# EAGLE design Height_Gauge-2-1 (EAGLE 7.0.0)
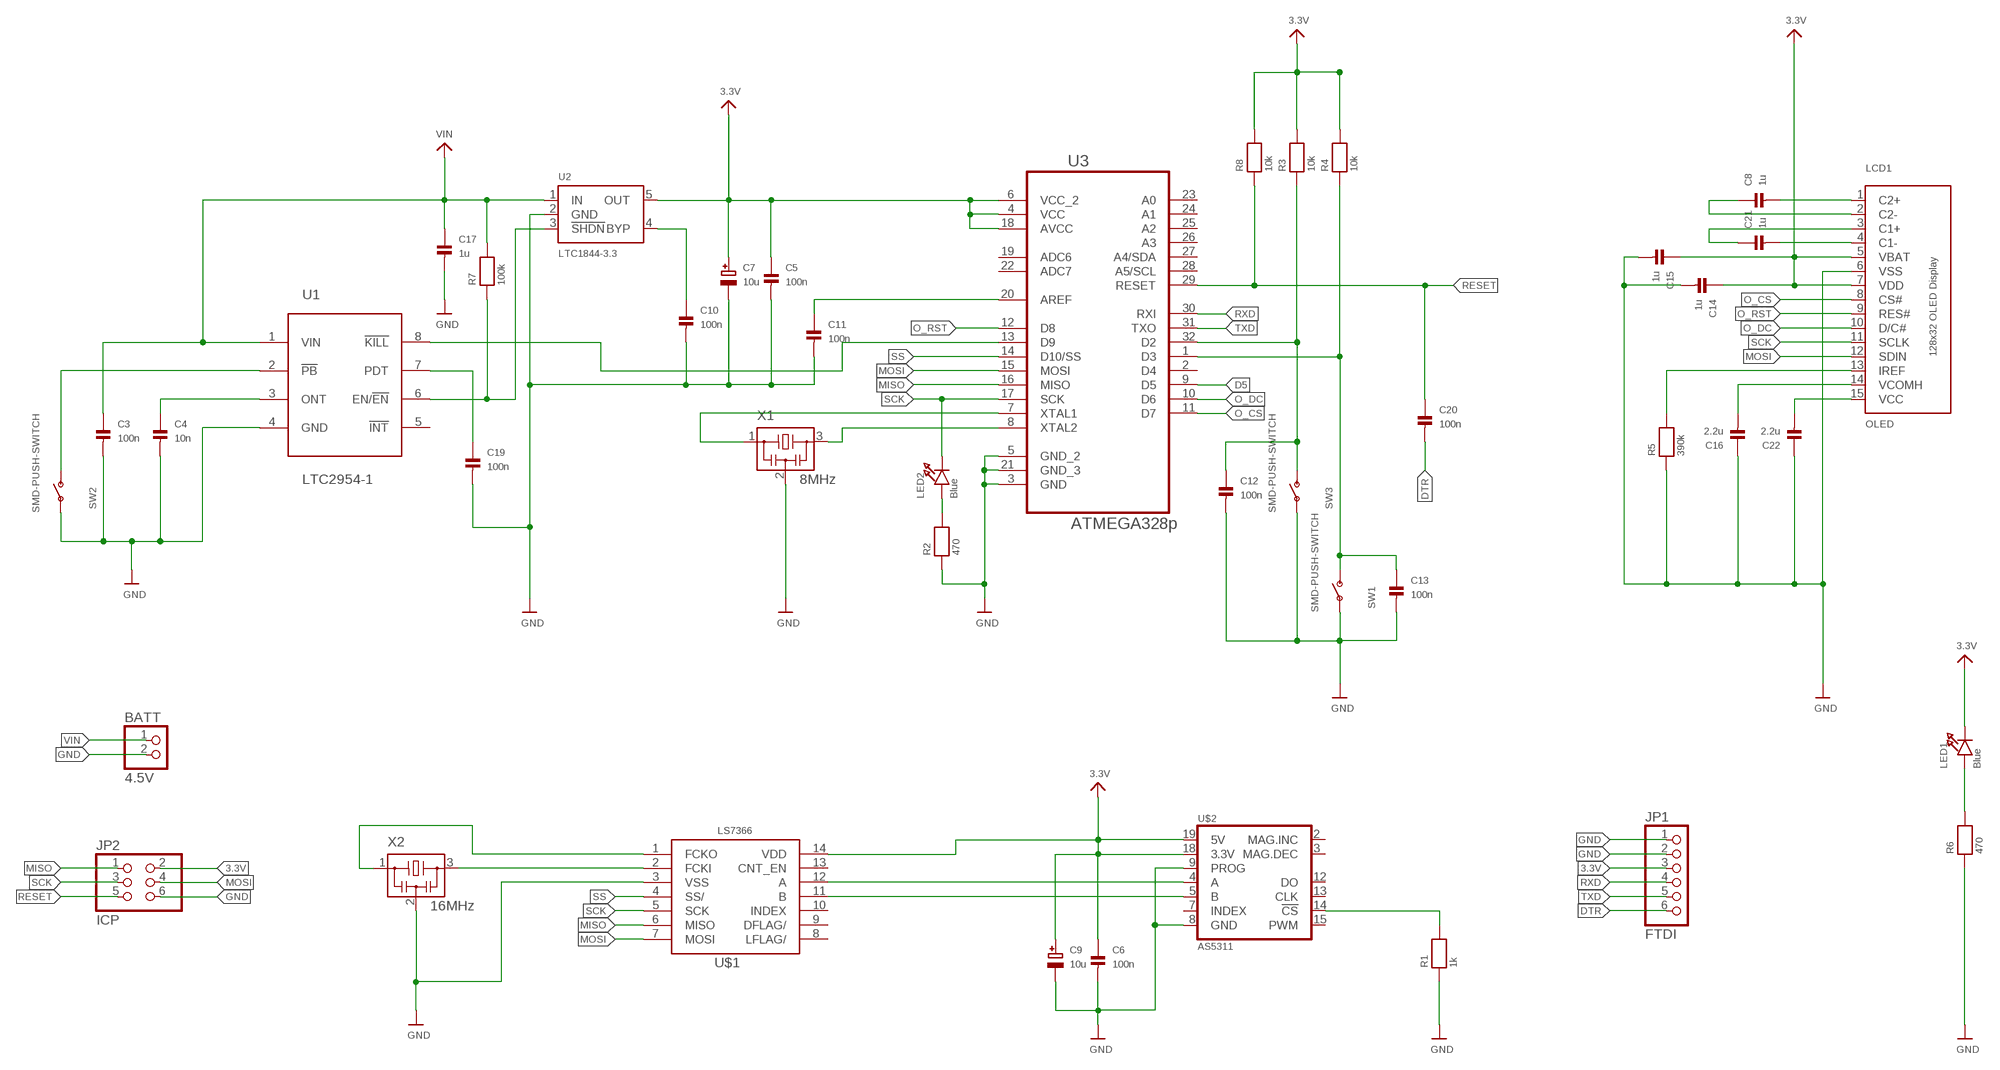
[diagram p0: schematic, sheet 1]

## Parts
BATT  4.5V  PINHD-1X2  [1X02]
C3  100n  CAP_CERAMIC0805  [0805]
C4  10n  CAP_CERAMIC0805  [0805]
C5  100n  CAP_CERAMIC0805  [0805]
C6  100n  CAP_CERAMIC0805  [0805]
C7  10u  CAP_TANTALUMA/3216_WAVE  [EIA3216-18/A-W]
C8  1u  CAP_CERAMIC0805  [0805]
C9  10u  CAP_TANTALUMA/3216_WAVE  [EIA3216-18/A-W]
C10  100n  CAP_CERAMIC0805  [0805]
C11  100n  CAP_CERAMIC0805  [0805]
C12  100n  CAP_CERAMIC0805  [0805]
C13  100n  CAP_CERAMIC0805  [0805]
C14  1u  CAP_CERAMIC0805  [0805]
C15  1u  CAP_CERAMIC0805  [0805]
C16  2.2u  CAP_CERAMIC0805  [0805]
C17  1u  CAP_CERAMIC0805  [0805]
C19  100n  CAP_CERAMIC0805  [0805]
C20  100n  CAP_CERAMIC0805  [0805]
C21  1u  CAP_CERAMIC0805  [0805]
C22  2.2u  CAP_CERAMIC0805  [0805]
JP1  FTDI  PINHD-1X6B  [1X06-BIG]
JP2  ICP  PINHD-2X3  [2X03]
LCD1  OLED  DISP_OLED_UG-2832HSWEG04WRAPAROUND  [UG-2832HSWEG04_WRAPAROUND]
LED1  Blue  LED0805  [CHIPLED_0805]
LED2  Blue  LED0805  [CHIPLED_0805]
R1  1k  RESISTOR0805  [0805]
R2  470  RESISTOR0805  [0805]
R3  10k  RESISTOR0805  [0805]
R4  10k  RESISTOR0805  [0805]
R5  390k  RESISTOR0805  [0805]
R6  470  RESISTOR0805  [0805]
R7  100k  RESISTOR0805  [0805]
R8  10k  RESISTOR0805  [0805]
SW1  SMD-PUSH-SWITCH  [PUSH-BUTTON-SMD]
SW2  SMD-PUSH-SWITCH  [PUSH-BUTTON-SMD]
SW3  SMD-PUSH-SWITCH  [PUSH-BUTTON-SMD]
U1  LTC2954-1  LTC2954  [TSOT23-8]
U2  LTC1844-3.3  LTC1844  [TSOT23-5]
U3  ATMEGA328p  ATMEGA328P-AU  [TQFP-32]
U$1  LS7366  [SO14]
U$2  AS5311  [TSSOP.20]
X1  8MHz  CSTCE-CRYSTAL-OSC  [CSTCE-CRYSTAL-OSC]
X2  16MHz  CSTCE-CRYSTAL-OSC  [CSTCE-CRYSTAL-OSC]

## Nets
3.3V: C5.1 C6.1 C7.+ C9.+ C14.1 C15.1 JP1.3 JP2.2 LCD1.5(VBAT) LCD1.7(VDD) LED1.C R3.2 R4.2 R8.2 U2.5(OUT) U3.4(VCC) U3.6(VCC_2) U3.18(AVCC) U$1.14(VDD) U$2.18(3.3V) U$2.19(5V)
D5: U3.9(D5)
DTR: C20.2 JP1.6
GND: BATT.2 C3.2 C4.2 C5.2 C6.2 C7.- C9.- C10.2 C11.2 C12.2 C13.2 C14.2 C15.2 C16.1 C17.2 C19.2 C22.1 JP1.1 JP1.2 JP2.6 LCD1.6(VSS) R1.1 R2.1 R5.1 R6.1 SW1.P$1(P) SW2.P$1(P) SW3.P$1(P) U1.4(GND) U2.2(GND) U3.3(GND) U3.5(GND_2) U3.21(GND_3) U$1.3(VSS) U$2.8(GND) U$2.9(PROG) X1.2 X2.2
KILL: U1.8(!KILL) U3.13(D9)
MISO: JP2.1 U3.16(MISO) U$1.6(MISO)
MOSI: JP2.4 LCD1.12(SDIN) U3.15(MOSI) U$1.7(MOSI)
N$1: U$1.2(FCKI) X2.3
N$2: U$1.1(FCKO) X2.1
N$3: R7.1 U1.6(EN/!EN) U2.3(!SHDN)
N$4: R1.2 U$2.14(!CS)
N$5: SW2.P$2(S) U1.2(!PB)
N$6: U$1.12(A) U$2.4(A)
N$7: U$1.11(B) U$2.5(B)
N$8: C4.1 U1.3(ONT)
N$9: C10.1 U2.4(BYP)
N$10: C11.1 U3.20(AREF)
N$11: C12.1 R3.1 SW3.P$2(S) U3.32(D2)
N$12: U3.7(XTAL1) X1.1
N$13: U3.8(XTAL2) X1.3
N$14: C13.1 R4.1 SW1.P$2(S) U3.1(D3)
N$15: LED2.A R2.2
N$16: C8.2 LCD1.1(C2+)
N$17: LED1.A R6.2
N$18: C19.1 U1.7(PDT)
N$19: C8.1 LCD1.2(C2-)
N$22: C21.2 LCD1.4(C1-)
N$23: C21.1 LCD1.3(C1+)
N$24: LCD1.13(IREF) R5.2
N$25: C16.2 LCD1.14(VCOMH)
N$26: C22.2 LCD1.15(VCC)
O_CS: LCD1.8(CS#) U3.11(D7)
O_DC: LCD1.10(D/C#) U3.10(D6)
O_RST: LCD1.9(RES#) U3.12(D8)
RESET: C20.1 JP2.5 R8.1 U3.29(RESET)
RXD: JP1.4 U3.30(RXI)
SCK: JP2.3 LCD1.11(SCLK) LED2.C U3.17(SCK) U$1.5(SCK)
SS: U3.14(D10/SS) U$1.4(SS/)
TXD: JP1.5 U3.31(TXO)
VIN: BATT.1 C3.1 C17.1 R7.2 U1.1(VIN) U2.1(IN)
Unconnected: U1.5(!INT) U3.2(D4) U3.19(ADC6) U3.22(ADC7) U3.23(A0) U3.24(A1) U3.25(A2) U3.26(A3) U3.27(A4/SDA) U3.28(A5/SCL) U$1.8(LFLAG/) U$1.9(DFLAG/) U$1.10(INDEX) U$1.13(CNT_EN) U$2.2(MAG.INC) U$2.3(MAG.DEC) U$2.7(INDEX) U$2.12(DO) U$2.13(CLK) U$2.15(PWM)

## Library data of the parts
BATT = pinhead:PINHD-1X2: PIN HEADER
C3-C6 C8 C10-C17 C19-C22 = microbuilder:CAP_CERAMIC: Ceramic Capacitors 0402 - 0402 Surface Mount Capacitors 16pF 50V 5% [Digikey: 445-4899-2-ND] 18pF 50V 5% [Digikey: 490-1281-2-ND] 22pF 50V 5% [Digikey: 490-1283-2-ND] 68pF 50V 5% [Digikey: 490-1289-2-ND] 0.1uF 10V 10% [Digikey: 490-1318-2-ND] 1.0uF 6.3V 10% [Digikey: 490-1320-2-ND] 0603 - 0603 Surface Mount Capacitors 16 pF 50V 5% [Digikey: 445-5051-2-ND] 22 pF 50V [Digikey: PCC220ACVTR-ND] 33 pF 50V 5% [Digikey: 490-1415-1-ND] 56pF 50V 5% [Digikey: 490-1421-1-ND] 220pF 50V 5% [Digikey: 445-1285-1-ND] 680 pF 50V 2200 pF 50V 5% C0G [Digikey: 445-1297-1-ND] 5600 pF 100V 5% X7R [Digikey: 478-3711-1-ND] 0.1 µF 25V 10% [Digikey: PCC2277TR-ND] 0.22 µF 16V 10% X7R [Digikey: 445-1318-1-ND] 1.0 µF 25V 10% [Digikey: 445-5146-2-ND] 0603 - RF Specific 3pF 250V +/-0.1pF RF [Digikey: 712-1347-1-ND] 18 pF 250V 5% [Digikey: 478-3505-1-ND or 712-1322-1-ND] 56 pF 250V 5% C0G RF [Digikey: 490-4867-1-ND] 68 pF 250V RF [Digikey: 490-4868-1-ND] 0805 - 0805 Surface Mount Capacitors 220 pF 250V 2% RF Ceramic Capacitor [Digikey: 712-1398-1-ND] 1000 pF 50V 2% NP0 Ceramic Capacitor [Digikey: 478-3760-1-ND] 0.1 µF 25V 10% Ceramic Capacitor [Digikey: PCC1828TR-ND] 1.0 µF 16V 10% Ceramic Capacitor[Digikey: 490-1691-2-ND] 10.0 µF 10V 10% Ceramic Capacitor[Digikey: 709-1228-1-ND] 10.0 uF 16V 10% Ceramic Capacitor [Digikey: 478-5165-2-ND] 47 uF 6.3V 20% Ceramic Capacitor [Digikey: 587-1779-1-ND or 399-5506-1-ND] 1206 - 1206 Surface Mount Capacitors 47uF 10V 20% Ceramic Capacitor [Digikey: 490-5528-1-ND or 399-5508-1-ND or 445-6010-1-ND] 100uF 6.3V -20%, +80% Y5V Ceramic Capacitor (Digikey: 490-4512-1-ND, Mouser: 81-GRM31CF50J107ZE1L)
C7 C9 = microbuilder:CAP_TANTALUM: Tantalum Capacitors Wave footprints have larger pads and are meant to be used for hand soldering. Reflow footprints are optimised for solder paste and a reflow oven. EIA3216-18/A-[R/W] - Size A / 3216-18 / 1206 footprint 4.7µF 25V 10% Tantalum Capacitor 10µF 16V 10% Tantalum Capacitor [Digikey: 495-2236-2-ND] EIA3528-21/B-[R/W] - Size B / 3528-21 47µF 10V 10% Tantalum Capactior [Digikey: 495-2216-1-ND] EIA6032-28/C-[R/W] - Size C / 6032-28 10µF 35V 20% Tantalum Capacitor [Digikey: 495-2285-1-ND] 100µF 16V 10% Tantalum Capactior [Digikey: 399-5214-1-ND]
JP1 = adafruit:PINHD-1X6: PIN HEADER
JP2 = pinhead:PINHD-2X3: PIN HEADER
LCD1 = microbuilder:DISP_OLED_UG-2832HSWEG04: 128x32 SPI 0.91" Monochrome OLED Display
LED1 LED2 = microbuilder:LED: LED 0603 - 0603 Surface Mount Package 2mA: Green LED - Low Power (3.9mcd, 2ma, 1.7Vf) - Digikey: 475-2709-2-ND Orange LED - Low Power (9.8mcd, 2ma, 1.8Vf) - Digikey: 475-1194-2-ND Red LED - Low Power (5mcd, 2ma, 1.8Vf) - Digikey: 475-1195-2-ND Yellow LED - Low Power (7mcd, 2ma, 1.8Vf) - Digikey: 475-1196-2-ND 5mA: Blue LED - Low Power (17mcd, 5ma, 2.9Vf) - Digikey: LNJ937W8CRACT-ND 0805 - 0805 Surface Mount Package 2mA: Red LED (8.8mcd, 2mA, 1.8Vf, Clear) - Low Power [Digikey: 475-2510-1-ND] Green LED (5mcd, 2mA, 1.8Vf, Clear) - Low Power [Digikey: 475-2730-1-ND] Yellow LED (11.3mcd, 2mA, 1.8Vf, Clear) - Low Power [Digikey: 475-2555-1-ND] 20mA: Red LED (104mcd, 20mA, Diffused) - LS R976 [Digikey: 475-1278-6-ND] Red LED (12mcd, 20mA, 2.0Vf, Clear) - APT2012EC [Digikey: 754-1128-1-ND] Green LED (15mcd, 20mA, 2.2Vf, Clear) - APT2012GC [Digikey: 754-1131-1-ND] Orange LED (160mcd, 20mA, 2.1Vf, Clear) - APT2012SECK [Digikey: 754-1130-1-ND] 1206 - 1206 Surface Mount Package Green LED (26mcd, 20mA, Diffused) - LG N971 [Digikey: 475-1407-6-ND] Red LED (15mcd, 20mA, Diffused) - LH N974 [Digikey: 475-1416-6-ND]
R1-R8 = microbuilder:RESISTOR: Resistors 0402 - 0402 Surface Mount Package 22 Ohm 1% 1/16W [Digikey: 311-22.0LRTR-ND] 33 Ohm 5% 1/16W 1.0K 5% 1/16W 1.5K 5% 1/16W 2.0K 1% 1/16W 10.0K 1% 1/16W [Digikey: 311-10.0KLRTR-ND] 10.0K 5% 1/16W [Digikey: RMCF0402JT10K0TR-ND] 12.1K 1% 1/16W [Digikey: 311-22.0LRTR-ND] 100.0K 5% 1/16W 0603 - 0603 Surface Mount Package 0 Ohm 1/10 Watt 1% Resistor 15 Ohm 1/10 Watt 1% Resistor 33 Ohm 1/10 Watt 1% Resistor 49.9 Ohm 1/10 Watt 1% Resistor 100 Ohm 1/10 Watt 1% Resistor 150 Ohm 1/10 Watt 1% Resistor 240 Ohm 1/10 Watt 1% Resistor 390 Ohm 1/10 Watt 1% Resistor 560 Ohm 1/10 Watt 1% Resistor 680 Ohm 1/10 Watt 1% Resistor 750 Ohm 1/10 Watt 1% Resistor 1.0K Ohm 1/10 Watt 1% Resistor 1.5K Ohm 1/10 Watt 1% Resistor 2.0K Ohm 1/10 Watt 1% Resistor 2.2K Ohm 1/10 Watt 1% Resistor 3.3K Ohm 1/10 Watt 1% Resistor 4.7K Ohm 1/10 Watt 1% Resistor 10.0K Ohm 1/10 Watt 1% Resistor 12.0K Ohm 1/10 Watt 1% Resistor 12.1K Ohm 1/10 Watt 1% Resistor 20.0K Ohm 1/10 Watt 1% Resistor 33.0K Ohm 1/10 Watt 1% Resistor 100.0K Ohm 1/10 Watt 1% Resistor 0805 - 0805 Surface Mount Package 0 Ohm 1/8 Watt 1% Resistor 33 Ohm 1/8 Watt 1% Resistor 100 Ohm 1/8 Watt 1% Resistor 150 Ohm 1/8 Watt 1% Resistor 200 Ohm 1/8 Watt 1% Resistor 240 Ohm 1/8 Watt 1% Resistor 330 Ohm 1/8 Watt 1% Resistor 390 Ohm 1/8 Watt 1% Resistor 470 Ohm 1/8 Watt 1% Resistor 1.0K Ohm 1/8 Watt 1% Resistor 1.5K Ohm 1/8 Watt 1% Resistor 2.0K Ohm 1/8 Watt 1% Resistor 4.7K Ohm 1/8 Watt 1% Resistor 5.1K Ohm 1/8 Watt 1% Resistor 5.6K Ohm 1/8 Watt 1% Resistor 10.0K Ohm 1/8 Watt 1% Resistor 22.0K Ohm 1/8 Watt 1% Resistor 33.0K Ohm 1/8 Watt 1% Resistor 100K Ohm 1/8 Watt 1% Resistor 1206 - 1206 Surface Mount Package 2012 - 2010 Surface Mount Package 0.11 Ohm 1/2 Watt 1% Resistor - Digikey: RHM.11UCT-ND
SW1-SW3 = Peters:SMD-PUSH-SWITCH
U1 = Peters:LTC2954: Linear LTC2954 Push button On/Off Controller
U2 = Peters:LTC1844
U3 = Peters:ATMEGA328P-AU
U$1 = LSI-2:LS7366: LS7366 32-Bit Quadrature Counter with SPI Interface
U$2 = AustrianMicro:AS5311
X1 X2 = Peters:CSTCE-CRYSTAL-OSC: Murata CSTCE series Ceramic Resonator

## Board
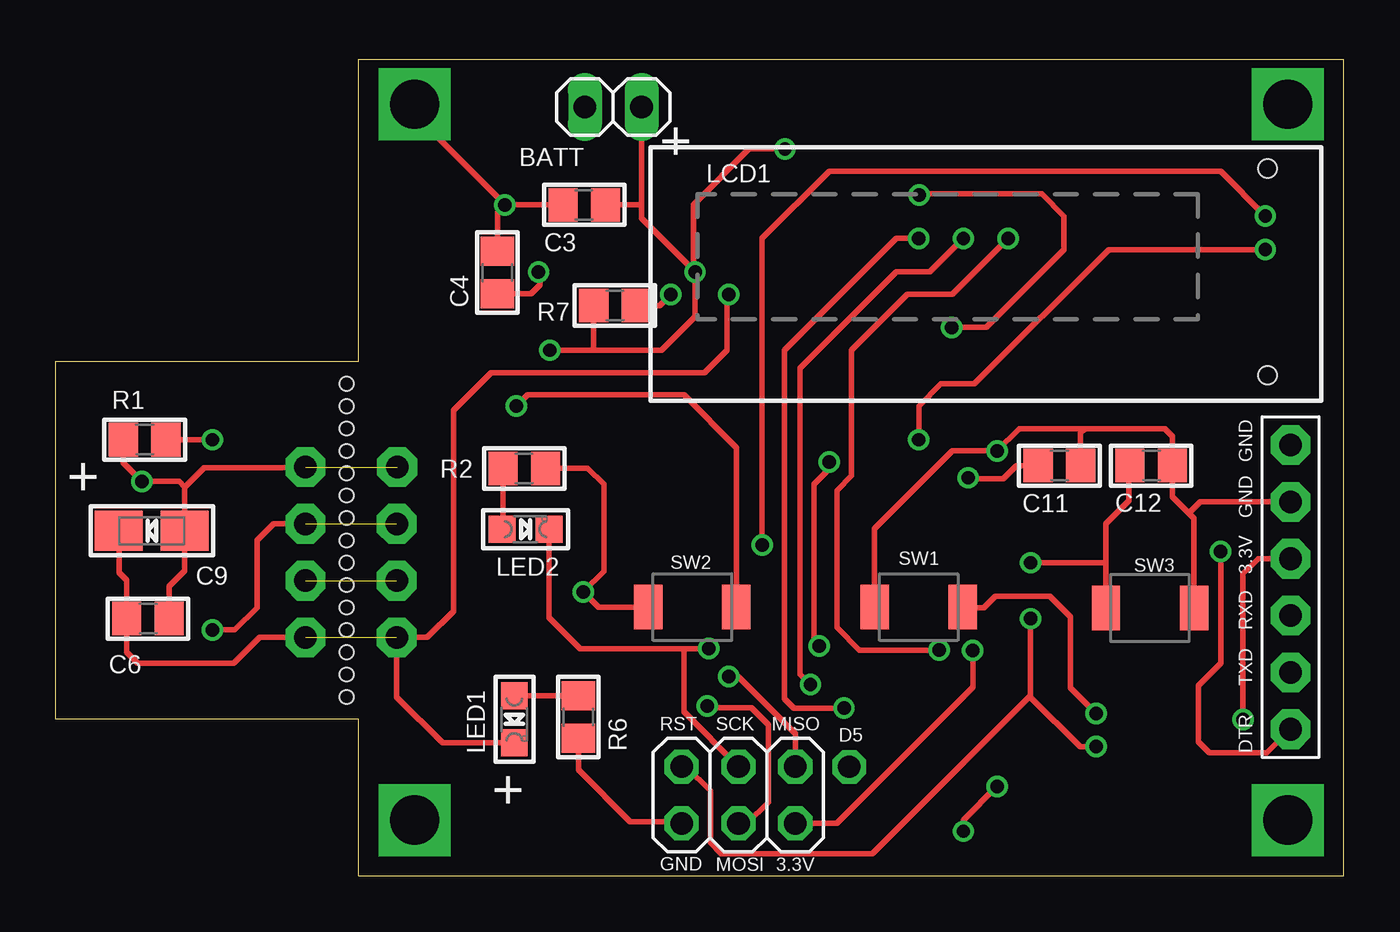
[diagram p1: board, top side]
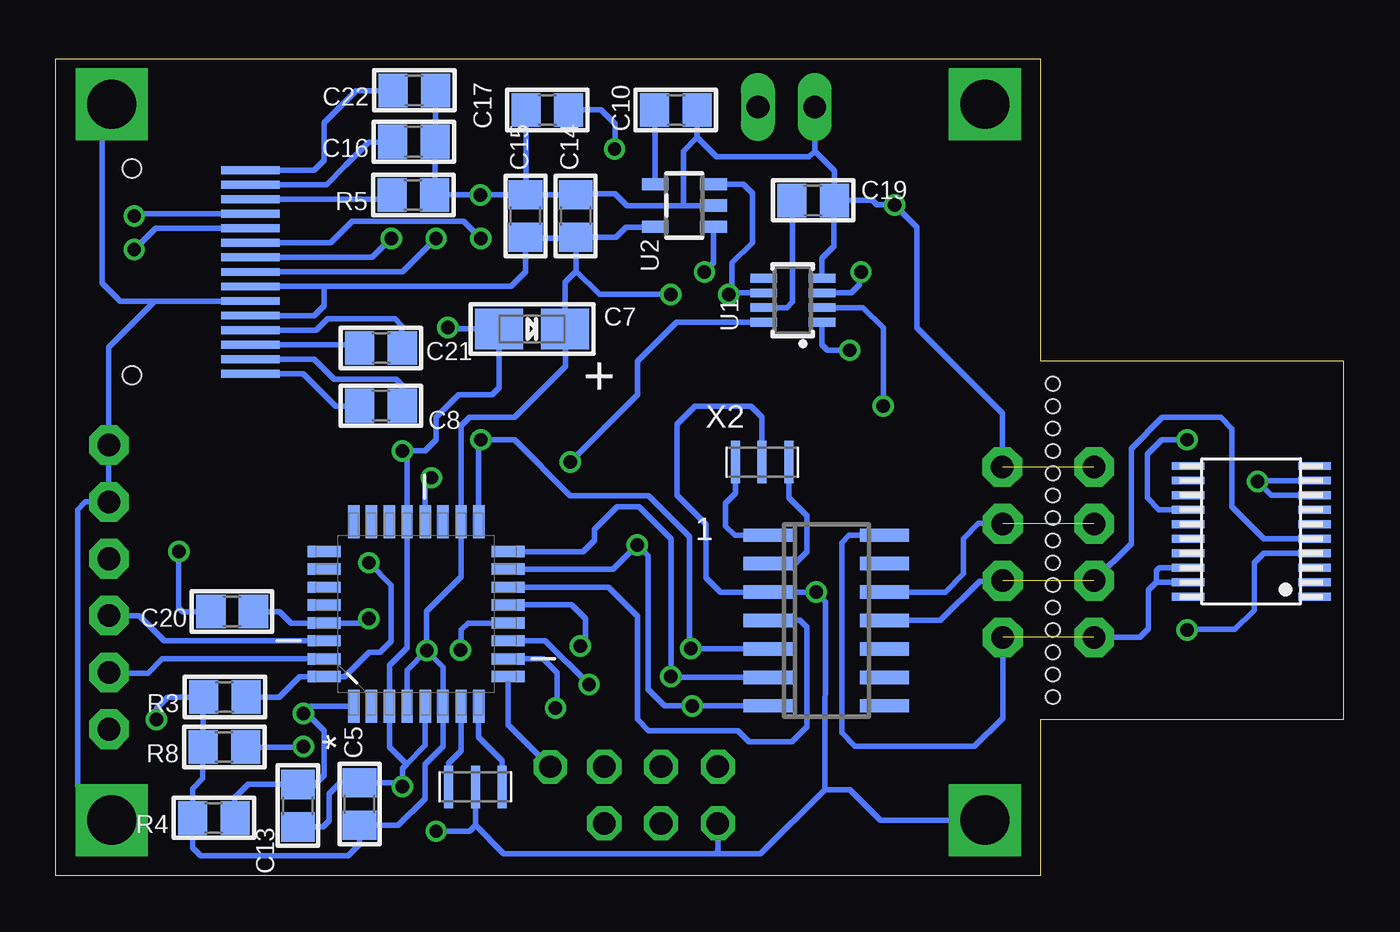
[diagram p2: board, bottom side, seen from below]

Size 57.58 x 36.5 mm. Coordinates in mm from the lower left corner, seen from the top.
Outline: 13.54,0 57.58,0 57.58,36.5 13.54,36.5 13.54,23 0,23 0,7 13.54,7 13.54,0
Copper layers (1*16): Top 0.0356mm / dielectric 1.5011mm / Bottom 0.0356mm
Design rules "LaenPCBOrder": minimum track width 6mil, minimum drill 13mil, track to track 6mil, track to pad 6mil, pad to pad 6mil, via to via 6mil, smd to smd 6mil, copper to edge 15mil, drill to drill 6mil, minimum pad ring 7mil, minimum via ring 7mil, stop-mask expansion 3mil, vias tented up to drill 0mil, thermal gap 10mil
Holes 0.6 mm at 13,21 13,20 13,19 13,18 13,17 13,16 13,15 13,14 13,13 13,12 13,11 13,10 13,9 13,8 13,22

### Footprints (pad centres in the part's own frame; a part is rotated, then mirrored left to right if it is on the bottom)
1X02 = drill 1.016 long: 1 -1.27,0; 2 1.27,0
0805 = smd 1.3 x 1.5: 1 -0.95,0; 2 0.95,0
EIA3216-18/A-W = smd 2.15 x 1.8: + 1.475,0; - -1.475,0
1X06-BIG = drill 1.016 pad 1.778 octagon: 1 -6.35,0; 2 -3.81,0; 3 -1.27,0; 4 1.27,0; 5 3.81,0; 6 6.35,0
2X03 = drill 1.016 octagon: 1 -2.54,-1.27; 2 -2.54,1.27; 3 0,-1.27; 4 0,1.27; 5 2.54,-1.27; 6 2.54,1.27
UG-2832HSWEG04_WRAPAROUND = smd 2.6 x 0.35 bottom: 1 -7.7,-4.55; 2 -7.7,-3.9; 3 -7.7,-3.25; 4 -7.7,-2.6; 5 -7.7,-1.95; 6 -7.7,-1.3; 7 -7.7,-0.65; 8 -7.7,0; 9 -7.7,0.65; 10 -7.7,1.3; 11 -7.7,1.95; 12 -7.7,2.6; 13 -7.7,3.25; 14 -7.7,3.9; 15 -7.7,4.55 | hole 0.8: -2.4,4.625; -2.4,-4.625
CHIPLED_0805 = smd 1.2 x 1.2: A 0,-1.05; C 0,1.05
PUSH-BUTTON-SMD = smd 1.27 x 2: P$1 -2.22,0; P$2 1.72,0
TSOT23-8 = smd 0.4 x 1.2: 1 -1.07,-1.3; 2 -0.42,-1.3; 3 0.23,-1.3; 4 0.88,-1.3; 5 0.88,1.3; 6 0.23,1.3; 7 -0.42,1.3; 8 -1.07,1.3
TSOT23-5 = smd 0.55 x 1.2: 1 -0.95,-1.3; 2 0,-1.3; 3 0.95,-1.3; 4 0.95,1.3; 5 -0.95,1.3
TQFP-32 = smd 1.473 x 0.508: 1 -4.115,2.794; 2 -4.115,2.007; 3 -4.115,1.194; 4 -4.115,0.406; 5 -4.115,-0.406; 6 -4.115,-1.194; 7 -4.115,-2.007; 8 -4.115,-2.794; 17 4.115,-2.794; 18 4.115,-2.007; 19 4.115,-1.194; 20 4.115,-0.406; 21 4.115,0.406; 22 4.115,1.194; 23 4.115,2.007; 24 4.115,2.794 | smd 0.508 x 1.473: 9 -2.794,-4.115; 10 -2.007,-4.115; 11 -1.194,-4.115; 12 -0.406,-4.115; 13 0.406,-4.115; 14 1.194,-4.115; 15 2.007,-4.115; 16 2.794,-4.115; 25 2.794,4.115; 26 2.007,4.115; 27 1.194,4.115; 28 0.406,4.115; 29 -0.406,4.115; 30 -1.194,4.115; 31 -2.007,4.115; 32 -2.794,4.115
SO14 = smd 0.6 x 2.2: 1 -3.81,-2.6; 2 -2.54,-2.6; 3 -1.27,-2.6; 4 0,-2.6; 5 1.27,-2.6; 6 2.54,-2.6; 7 3.81,-2.6; 8 3.81,2.6; 9 2.54,2.6; 10 1.27,2.6; 11 0,2.6; 12 -1.27,2.6; 13 -2.54,2.6; 14 -3.81,2.6
TSSOP.20 = smd 0.35 x 1.45: 1 -2.925,-2.825; 2 -2.275,-2.825; 3 -1.625,-2.825; 4 -0.975,-2.825; 5 -0.325,-2.825; 6 0.325,-2.825; 7 0.975,-2.825; 8 1.625,-2.825; 9 2.275,-2.825; 10 2.925,-2.825; 11 2.925,2.825; 12 2.275,2.825; 13 1.625,2.825; 14 0.975,2.825; 15 0.325,2.825; 16 -0.325,2.825; 17 -0.975,2.825; 18 -1.625,2.825; 19 -2.275,2.825; 20 -2.925,2.825
CSTCE-CRYSTAL-OSC = smd 0.4 x 1.9: 1 -1.2,0; 2 0,0; 3 1.2,0

### Placement (x,y rotation side)
BATT  24.92,34.37 180 top
C3  23.62,30 180 top
C4  19.74,26.97 90 top
C5  44,3.21 90 bottom
C6  4.12,11.5 0 top
C7  36.29,24.45 0 bottom
C8  43.04,21.02 180 bottom
C9  4.29,15.43 180 top
C10  29.86,34.24 0 bottom
C11  44.87,18.34 0 top
C12  48.98,18.34 0 top
C13  46.76,3.14 270 bottom
C14  34.34,29.5 90 bottom
C15  36.58,29.5 90 bottom
C16  41.58,32.82 180 bottom
C17  35.6,34.24 180 bottom
C19  23.72,30.2 0 bottom
C20  49.7,11.82 180 bottom
C21  43.04,23.6 0 bottom
C22  41.56,35.12 180 bottom
JP1  55.21,12.91 270 top
JP2  30.52,3.62 180 top
LCD1  56.58,27 0 top
LED1  20.5,7 180 top
LED2  21,15.5 270 top
R1  3.97,19.5 0 top
R2  20.94,18.22 180 top
R3  50.03,8 180 bottom
R4  50.52,2.6 180 bottom
R5  41.6,30.44 180 bottom
R6  23.36,7.1 90 top
R7  25,25.5 180 top
R8  50.05,5.76 180 bottom
SW1  38.83,12.02 0 top
SW2  28.71,12.02 0 top
SW3  48.67,11.98 180 top
U1  24.63,25.83 90 bottom
U2  29.48,29.97 90 bottom
U3  41.47,11.71 90 bottom
U$1  23.13,11.42 270 bottom
U$2  4.13,15.4 90 bottom
X1  38.82,3.98 0 bottom
X2  26,18.5 0 bottom

### Tracks (layer width: path | path; a pad name or v marks a point on that pad's centre or on a via)
3.3V  (via drill 0.6, 1 pad 1.78)  (1 unrouted)
  Top 0.254: JP2.2 34.93,2.35 41,8.44 v41,10.08 | JP1.3 53.76,14.18 53.08,13.5 v53.08,7 | v11.16,10.66 9.1,10.66 7.94,9.5 3.66,9.5 3.17,9.99 C6.1 3.17,13.21 2.82,13.56 C9.+ | v30.08,26 30,25.92 30,23.5 29,22.5 19.46,22.5 17.78,20.82 17.78,11.84 16.6,10.66 v15.24,10.66 15.24,8 17.29,5.95 LED1.C
  Bottom 0.254: LCD1.7 45.58,26.35 | 45.58,26.35 37.23,26.35 36.58,27 36.58,28.5 | C15.1 36.58,28.5 | 36.58,28.5 34.39,28.5 C14.1 | C14.1 32.53,28.55 32.08,29 30.8,29 U2.5 | LCD1.5 46.03,25.05 45.58,25.5 45.58,26.35 | U3.4 41.88,9.2 v41,10.08 | v53.08,7 53.08,7.5 52.58,8 R3.2 51,7.98 R8.2 51.02,5.74 51.02,4.36 51.47,3.91 R4.2 51.46,1.26 51.1,0.9 44.52,0.9 44,1.42 C5.1 42.28,2.26 41.08,3.46 41.08,5 40.28,5.8 U3.6 40.28,9.34 v41,10.08 | 34.32,27.04 34.81,26.55 C7.+ 34.78,24.41 34.78,22.78 37.06,20.5 39.08,20.5 39.46,20.12 U3.18 39.46,13.38 41,11.84 v41,10.08 | 34.32,27.04 34.32,28.53 C14.1 | U$1.14 22.11,15.23 22.44,14.9 22.44,6.4 21.84,5.8 16.5,5.8 15.24,7.06 v15.24,10.66 | U$2.19 8.38,13.12 | 8.38,13.12 8.72,12.78 8.72,11.04 9.1,10.66 v11.16,10.66 | U$2.18 8.24,13.78 8.38,13.64 8.38,13.13 8.38,13.12 | v30.08,26 33.28,26 34.32,27.04
D5  (via drill 1 pad 1.42)
  Bottom 0.254: 35.5,4.88 v35.48,4.88 37.35,6.75 U3.9
DTR  (via drill 0.6)
  Top 0.254: v52.08,14.5 52.08,9.5 51.08,8.5 51.08,6 51.58,5.5 54.15,5.5 JP1.6
  Bottom 0.254: C20.2 51.9,11.82 52.08,12 v52.08,14.5
GND  (via drill 0.6, 1 pad 1.78, 2.2)  (1 unrouted)
  Top 0.254: v40.58,2 40.58,2.5 v42.08,4 | 50.67,16.21 49.92,16.96 C12.2 49.93,19.65 49.58,20 46.04,20 | JP1.2 51.18,16.72 50.67,16.21 | 46.04,20 43.08,20 v42.08,19 40.08,19 36.61,15.53 SW1.P$1 | C11.2 45.82,19.78 46.04,20 | v40.06,24.52 41.6,24.52 45.08,28 45.08,29.5 44.08,30.5 38.66,30.5 v38.6,30.44 | C3.2 v20.08,30 | C4.2 19.74,29.66 v20.08,30 | C6.2 5.07,12.95 5.76,13.64 C9.- 5.76,17.39 | 5.76,17.39 6.62,18.24 10.12,18.24 v11.16,18.28 | R1.1 3.02,18.46 v3.84,17.64 5.51,17.64 5.76,17.39 | 27.93,2.4 JP2.6 27.91,2.42 25.68,2.42 23.36,4.74 R6.1 | v16.04,34.5 16.04,34.04 v20.08,30 | SW2.P$1 24.26,12.02 v23.58,12.7 24.5,13.62 24.5,17.5 23.78,18.22 R2.1 | SW3.P$1 50.89,15.99 50.67,16.21
  Bottom 0.254: C22.1 40.61,32.84 C16.1 40.63,30.46 R5.1 v38.6,30.44 v38.59,30.45 C15.2 | U3.5 41.06,5.84 41.9,5 | 41.9,5 42.66,5.76 U3.3 42.66,9.42 41.88,10.2 U3.21 41.88,18.8 v42.08,19 41.08,19 40.58,19.5 40.58,20.5 39.58,21.5 38.08,21.5 37.77,21.82 C7.- 39.99,24.45 v40.06,24.52 | 54.91,2.33 v55.08,2.5 56.6,4.02 56.6,16.38 56.26,16.72 JP1.2 JP1.1 55.22,23.64 53.16,25.7 | X1.2 38.82,2.26 | 38.82,2.26 39.08,2 v40.58,2 | 41.9,5 42.08,4.82 v42.08,4 42.24,4.16 C5.2 44.88,4.16 45.36,3.68 45.36,2.46 45.62,2.2 C13.2 | 28.08,1 26.08,1 23.2,3.86 | 28.08,1 37.56,1 38.82,2.26 | LCD1.6 53.16,25.7 | U2.2 29.44,29.97 | 29.44,29.97 32.05,29.97 32.58,30.5 34.29,30.5 C14.2 C15.2 | C10.2 28.91,33.01 | 28.91,33.01 29.52,32.4 29.52,30.05 29.44,29.97 | C15.2 | U1.4 23.33,27.61 22.8,28.14 22.8,30.17 C19.2 | C19.2 22.77,31.53 23.64,32.4 | 28.91,33.01 28.04,32.14 23.9,32.14 23.64,32.4 | 23.64,32.4 BATT.2 | C19.2 21.06,30.2 20.86,30 v20.08,30 19.08,29 19.08,24.5 15.26,20.68 v15.26,18.28 | 23.2,3.86 23.18,12.26 v23.58,12.7 v23.59,12.69 U$1.3 27.87,12.69 28.5,13.32 28.5,15.72 29.8,17.02 29.8,20.2 29,21 26.5,21 26,20.5 X2.2 | JP2.6 27.98,1.1 28.08,1 | U$2.8 3.23,17.02 v3.84,17.64 3.81,17.68 U$2.9 | 53.16,25.7 54.7,25.7 55.5,26.5 55.5,34.08 v55.08,34.5 | 23.2,3.86 22.08,3.86 20.7,2.48 16.06,2.48 v16.04,2.5 | C17.2 36.55,30.48 C15.2
KILL  (via drill 0.6)
  Top 0.254: v34.58,18.5 34.58,18.2 33.9,17.52 33.9,10.52 v34.14,10.28
  Bottom 0.254: U1.8 29.82,24.76 31.58,23 31.58,21.5 v34.58,18.5 | U3.13 34.52,12.12 33.9,11.5 33.9,10.52 v34.14,10.28
MISO  (via drill 0.6)
  Top 0.254: v30.08,8.92 30.5,8.92 33.06,6.36 JP2.1
  Bottom 0.254: U$1.6 30.04,8.88 v30.08,8.92 30.08,15.08 31.5,16.5 32.5,16.5 33.5,15.5 33.5,15 34,14.5 U3.16 37.34,14.52
MOSI  (via drill 0.6)
  Top 0.254: JP2.4 30.91,2.35 31.86,3.3 31.86,6.76 31.1,7.52 29.2,7.52 v29.12,7.6 | v54.08,29.5 52.08,31.5 34.58,31.5 31.58,28.5 v31.58,14.8
  Bottom 0.254: U$1.7 v29.11,7.61 v29.12,7.6 v29.13,7.61 30.37,7.61 31.1,8.34 31.1,14.32 v31.58,14.8 32.66,13.72 U3.15 | LCD1.12 53.98,29.6 v54.08,29.5
N$1
  Bottom 0.254: U$1.2 24.54,13.96 24,14.5 24,16.1 24.8,16.9 X2.3
N$2
  Bottom 0.254: X2.1 27.2,17.1 27.64,16.66 27.64,15.64 27.22,15.22 U$1.1
N$3  (via drill 0.6)
  Top 0.254: R7.1 27,25.5 v27.5,26
  Bottom 0.254: U1.6 27.44,26.06 v27.5,26 27.34,26.16 27.34,27.4 26.44,28.3 26.44,30.52 26.84,30.92 U2.3
N$4  (via drill 0.6)
  Top 0.254: R1.2 v7,19.5
  Bottom 0.254: U$2.14 8.26,16.38 8.78,16.9 8.78,18.84 8.12,19.5 v7,19.5
N$5  (via drill 0.6)
  Top 0.254: v20.58,21 21.08,21.5 28.08,21.5 30.43,19.15 SW2.P$2
  Bottom 0.254: U1.2 21.49,25.41 20.58,24.5 v20.58,21
N$6  (via drill 0.6, 1 pad 1.78)  (1 unrouted)
  Top 0.254: v7,11 8,11 9,12 9,15 9.74,15.74 v11.16,15.74
  Bottom 0.254: U$1.12 17.81,12.69 17,13.5 17,15.08 16.32,15.76 15.26,15.76 v15.24,15.74 | U$2.4 3.58,14.43 4,14 4,11.88 4.86,11.02 6.98,11.02 v7,11
N$7  (via drill 1 pad 1.78)  (1 unrouted)
  Bottom 0.254: U$1.11 18.02,11.42 16.26,13.18 15.26,13.18 v15.24,13.2 | U$2.5 3.58,15.07 5,16.5 5,20 5.5,20.5 8.1,20.5 9.5,19.1 9.5,14.86 v11.16,13.2
N$8  (via drill 0.6)
  Top 0.254: C4.1 21.24,26.02 21.64,26.42 21.64,26.94 v21.58,27
  Bottom 0.254: U1.3 22,26.06 21.64,26.42 21.64,26.94 v21.58,27
N$9
  Bottom 0.254: U2.4 30.78,34.21 C10.1
N$10  (via drill 0.6)
  Top 0.254: C11.1 42.94,18.34 42.36,17.76 40.84,17.76 v40.8,17.8
  Bottom 0.254: U3.20 41.06,17.54 v40.8,17.8
N$11  (via drill 0.6)
  Top 0.254: C12.1 47.98,18.29 47.98,16.78 46.95,15.75 46.95,14 | v43.58,14 46.95,14 | SW3.P$2 46.95,14
  Bottom 0.254: R3.1 47.6,8 46.68,8.92 U3.32 44.66,8.92 43.58,10 43.08,10 42.58,10.5 42.58,13 v43.58,14
N$12
  Bottom 0.254: U3.7 39.46,5.6 40.02,5.04 X1.1
N$13
  Bottom 0.254: U3.8 38.68,6.2 37.62,5.14 X1.3
N$14  (via drill 0.6)
  Top 0.254: SW1.P$2 40.35,12 41.5,12 42,12.5 44.44,12.5 45.36,11.58 45.36,8.42 v46.52,7.26
  Bottom 0.254: U3.1 46.19,7.59 v46.52,7.26 46.34,7.26 45.58,6.5 45.58,4.5 46.08,4 46.67,4 C13.1 48.99,4.09 49.58,3.5 R4.1
N$15
  Top 0.254: R2.2 19.99,15.54 LED2.A
N$16
  Bottom 0.254: LCD1.1 46.53,22.45 45.08,21 44.01,21 C8.2
N$17
  Top 0.254: LED1.A R6.2
N$18
  Bottom 0.254: U1.7 24.89,25.41 24.64,25.66 24.64,30.17 C19.1
N$19
  Bottom 0.254: LCD1.2 46.04,23.1 45.14,22.2 42.36,22.2 42.1,21.94 C8.1
N$22
  Bottom 0.254: LCD1.4 45.94,24.4 45.44,24.9 42.42,24.9 42.12,24.6 42.12,23.63 C21.2
N$23
  Bottom 0.254: LCD1.3 44.14,23.75 C21.1
N$24
  Bottom 0.254: LCD1.13 42.74,30.25 R5.2
N$25
  Bottom 0.254: LCD1.14 45.48,30.9 44.62,31.76 44.62,31.78 43.6,32.8 42.55,32.8 C16.2
N$26
  Bottom 0.254: LCD1.15 46.03,31.55 45.58,32 45.58,33.68 44.16,35.1 42.53,35.1 C22.2
O_CS  (via drill 0.6)
  Top 0.254: v40.58,28.5 39.08,27 37.58,27 33.28,22.7 33.28,9.02 v33.74,8.56 33.58,8.72
  Bottom 0.254: LCD1.8 42.08,27 v40.58,28.5 | U3.11 35.7,10.52 v33.74,8.56
O_DC  (via drill 0.6)
  Top 0.254: v38.58,28.5 37.58,28.5 32.58,23.5 32.58,7.92 33,7.5 v35.24,7.5
  Bottom 0.254: LCD1.10 45.3,28.3 44.34,29.26 39.34,29.26 v38.58,28.5 | U3.10 35.8,9.7 35.18,9.08 35.18,7.56 v35.24,7.5
O_RST  (via drill 0.6)
  Top 0.254: v42.58,28.5 40.08,26 38.08,26 35.58,23.5 35.58,17.88 34.92,17.22 34.92,11.12 35.94,10.1 v39.5,10.1 39.46,10.14
  Bottom 0.254: LCD1.9 43.43,27.65 v42.58,28.5 | U3.12 39.16,11.3 39.46,11 39.46,10.14 v39.5,10.1
RESET  (via drill 0.6)
  Top 0.254: v43.58,11.5 43.58,8.06 | 43.58,8.06 43.58,8 45.8,5.78 v46.52,5.78 | JP2.5 28.17,4.89 29.26,3.8 29.26,1.48 29.74,1 36.52,1 43.58,8.06
  Bottom 0.254: C20.1 47.58,11.82 47.06,11.3 U3.29 43.78,11.3 v43.58,11.5 | 46.5,5.76 v46.52,5.78 46.54,5.76 R8.1
RXD
  Bottom 0.254: U3.30 52.74,10.52 53.86,11.64 JP1.4
SCK  (via drill 0.6)
  Top 0.254: v29.19,10.15 v29.2,10.16 28,10.16 | JP2.3 28.08,7.33 28.08,10.08 28,10.16 | v38.58,19.5 38.58,21 39.58,22 41.08,22 47.08,28 v54.08,28 | LED2.C 22.05,11.55 23.44,10.16 28,10.16
  Bottom 0.254: U$1.5 v29.19,10.15 v29.2,10.16 29.24,10.16 29.24,15.16 31.08,17 34.58,17 37.08,19.5 v38.58,19.5 38.68,19.4 U3.17 | LCD1.11 53.11,28.95 v54.08,28
SS
  Bottom 0.254: U3.14 34.85,12.9 32.86,12.9 31.58,11.62 31.58,7 31.08,6.5 27.08,6.5 26.58,6 24.66,6 24,6.66 24,11.12 24.3,11.42 U$1.4
TXD
  Bottom 0.254: U3.31 52.82,9.7 53.46,9.06 55.17,9.06 JP1.5
VIN  (via drill 0.6)
  Top 0.254: BATT.1 26.19,30 | 26.19,30 26.19,29.39 v28.58,27 | v22.08,23.5 24,23.5 | 24,23.5 27.08,23.5 28.58,25 v28.58,27 | C3.1 26.19,30 | v32.6,32.5 31,32.5 28.5,30 28.5,27.08 v28.58,27 | R7.2 24.05,23.55 24,23.5
  Bottom 0.254: U2.1 28.18,27.4 v28.58,27 | U1.1 23.33,23.75 23.08,23.5 v22.08,23.5 | C17.1 33.2,34.24 32.58,33.62 32.58,32.52 v32.6,32.5

### Text on the board
tNames: + | GND | + | GND | 3.3V | RXD | TXD | RST | SCK | MISO | D5 | DTR | + | GND | MOSI | 3.3V
bNames: + | 1